# EAGLE schematic syma-wireless-charger (EAGLE 7.5.0)
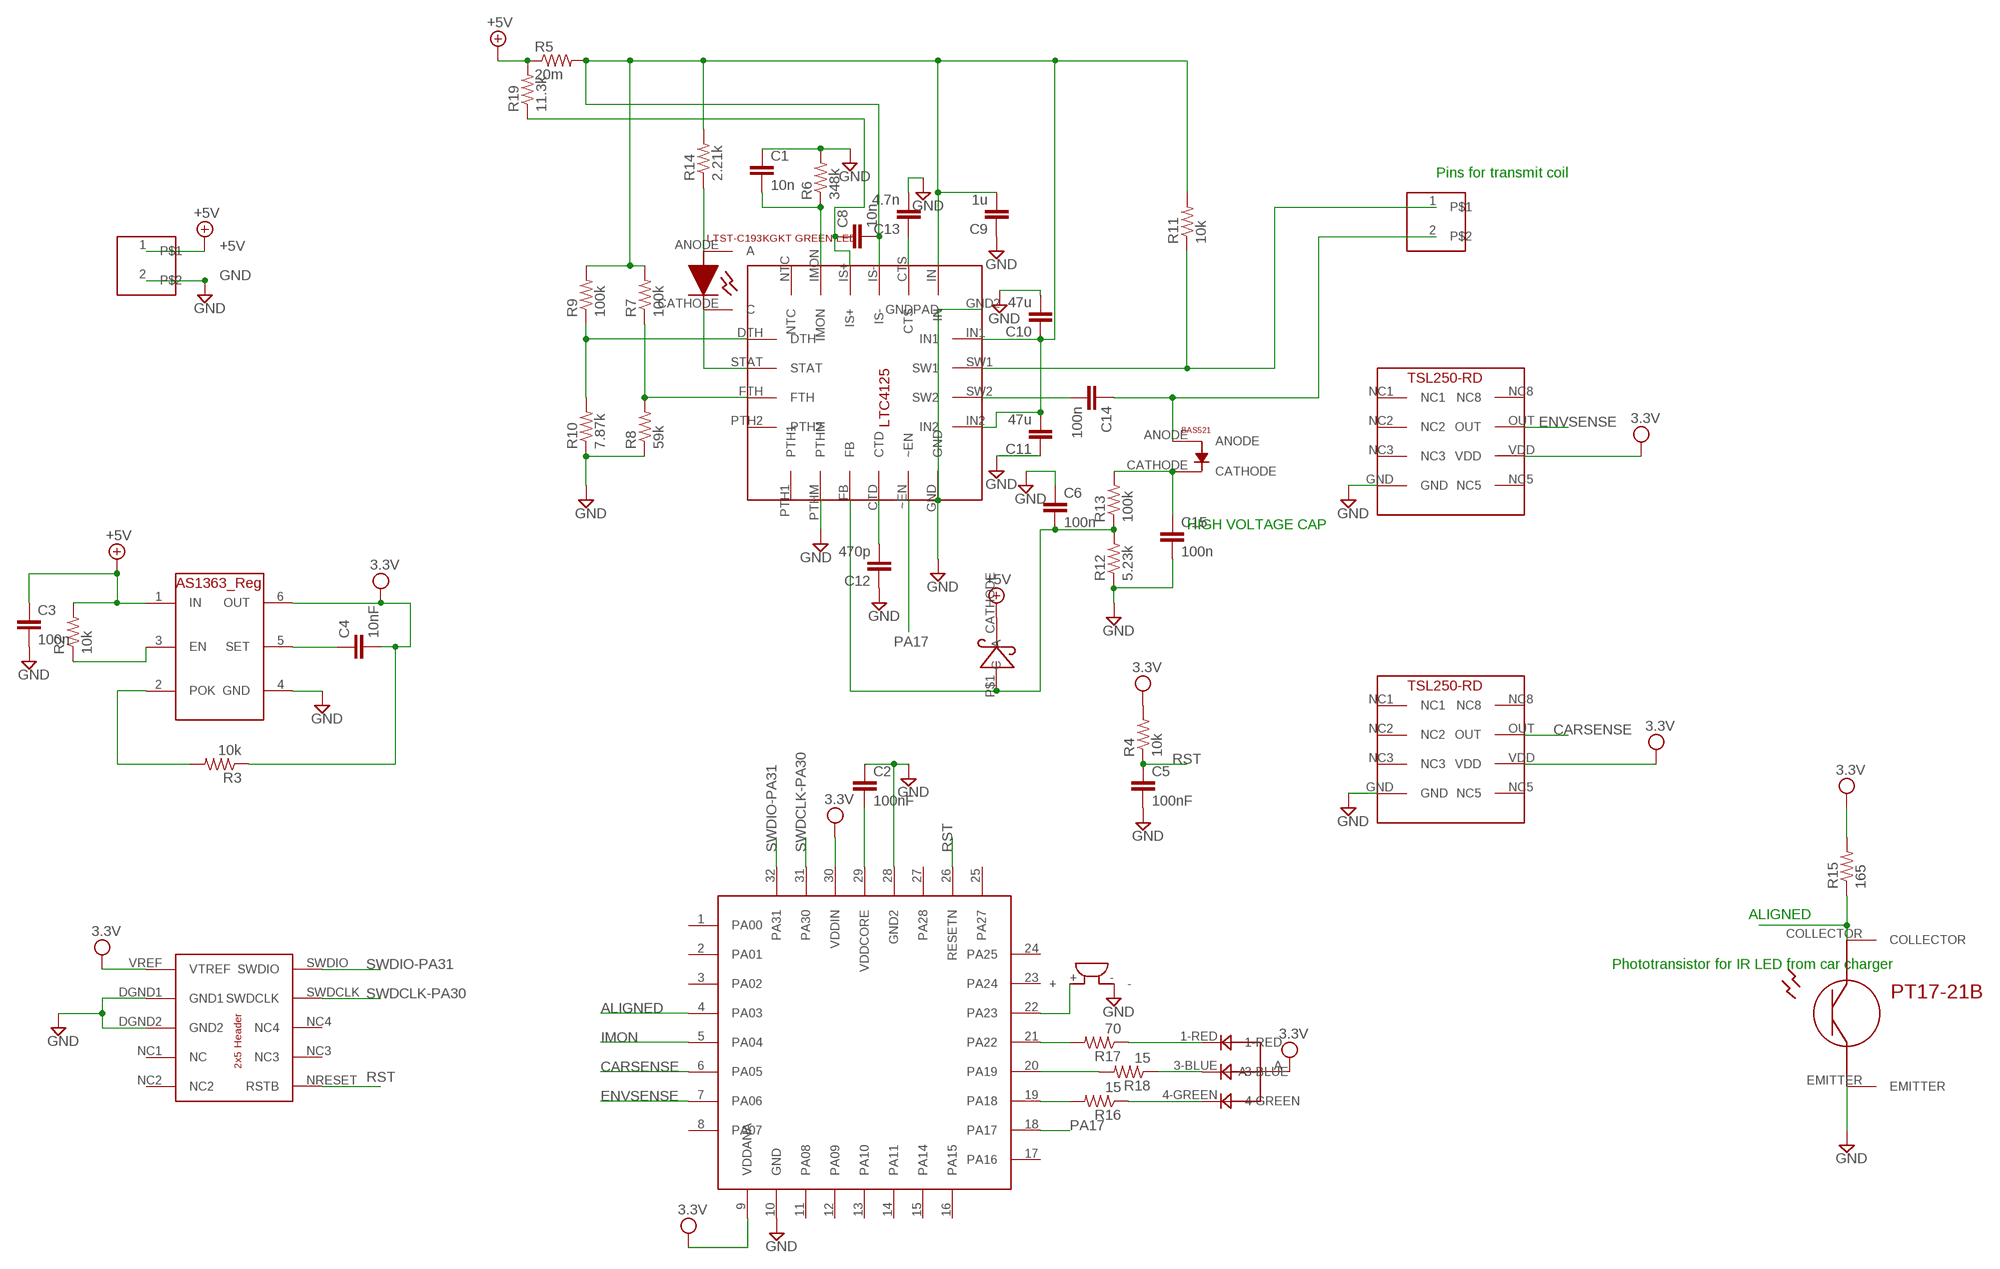
[diagram p0: schematic, sheet 1]

## Parts
C1  10n  C-EUC0805  [C0805]
C2  100nF  C-EUC0805K  [C0805K]
C3  100n  C-EUC0805K  [C0805K]
C4  10nF  C-EUC0805K  [C0805K]
C5  100nF  C-EUC0805K  [C0805K]
C6  100n  C-EUC0805  [C0805]
C8  10n  C-EUC0805  [C0805]
C9  1u  C-EUC0805  [C0805]
C10  47u  C-EUC0805  [C0805]
C11  47u  C-EUC0805  [C0805]
C12  470p  C-EUC0805  [C0805]
C13  4.7n  C-EUC0805  [C0805]
C14  100n  C-EUC1206  [C1206]
C15  100n  C-EUC0603  [C0603]
DBG1  DEBUGHEAD  [DEBUGHEAD]
R2  10k  R-US_R0805  [R0805]
R3  10k  R-US_R0805  [R0805]
R4  10k  R-US_R0805  [R0805]
R5  20m  R-US_R0805  [R0805]
R6  348k  R-US_R0805  [R0805]
R7  100k  R-US_R0805  [R0805]
R8  59k  R-US_R0805  [R0805]
R9  100k  R-US_R0805  [R0805]
R10  7.87k  R-US_R0805  [R0805]
R11  10k  R-US_R0805  [R0805]
R12  5.23k  R-US_R0805  [R0805]
R13  100k  R-US_R0805  [R0805]
R14  2.21k  R-US_R0805  [R0805]
R15  165  R-US_R0805  [R0805]
R16  15  R-US_R0805  [R0805]
R17  70  R-US_R0805  [R0805]
R18  15  R-US_R0805  [R0805]
R19  11.3k  R-US_R0805  [R0805]
U1  SAMD21E  [TQFP32-08]
U2  3.3V_AS1363  [SOT23-6]
U$1  LTC4125  [LTC1945-QFN]
U$2  BAS521  [BAS521-V-DIODE]
U$3  1X02  [1X02]
U$4  RGBLED  [RGBLED]
U$5  BUZZER  [BUZZER]
U$6  TSL250-RD  [TSL250-RD]
U$7  TSL250-RD  [TSL250-RD]
U$8  SCHTKYDIODE-523  [SOD-523]
U$9  LTST-C193KGKT_GREEN-LED  [LTST-C193KGKT_GREEN-LED]
U$10  PT17-21B_PHOTOTRANSISTOR  [PT17-21B_PHOTOTRANSISTOR]
U$11  1X02  [1X02]

## Nets
+5V: C3.1 R2.2 R5.1 R19.2 U2.1(IN) U$3.1 U$8.CATHODE(C)
ALIGNED: R15.1 U1.4(PA03) U$10.COLLECTOR
CARSENSE: U1.6(PA05) U$6.OUT
ENVSENSE: U1.7(PA06) U$7.OUT
GND: C1.1 C2.1 C3.2 C5.2 C6.1 C9.1 C10.2 C11.1 C12.1 C13.2 C15.2 DBG1.DGND1(GND1) DBG1.DGND2(GND2) R6.2 R8.1 R10.1 R12.1 U1.10(GND) U1.28(GND2) U2.4(GND) U$1.GND U$1.GND2(GNDPAD) U$1.PTHM U$3.2 U$5.- U$6.GND U$7.GND U$10.EMITTER
IMON: U1.5(PA04)
N$1: C2.2 U1.29(VDDCORE)
N$2: R3.2 U2.2(POK)
N$3: R2.1 U2.3(EN)
N$4: R9.1 R10.2 U$1.DTH
N$5: C4.1 U2.5(SET)
N$6: R7.1 R8.2 U$1.FTH
N$7: R11.1 U$1.SW1 U$11.1
N$8: C1.2 R6.1 U$1.IMON
N$9: C6.2 R12.2 R13.1 U$1.FB U$8.P$1(A)
N$10: C15.1 R13.2 U$2.CATHODE
N$11: R14.1 U$9.ANODE(A)
N$12: C14.1 U$2.ANODE U$11.2
N$13: R17.2 U1.21(PA22)
N$14: R18.2 U1.20(PA19)
N$15: R16.2 U1.19(PA18)
N$16: R16.1 U$4.4-GREEN
N$17: R18.1 U$4.3-BLUE
N$18: R17.1 U$4.1-RED
N$19: U1.22(PA23) U$5.+
N$20: C8.2 C9.2 C10.1 C11.2 R5.2 R7.2 R9.2 R11.2 R14.2 U$1.IN U$1.IN1 U$1.IN2 U$1.IS-
N$21: C8.1 R19.1 U$1.IS+
N$22: C14.2 U$1.SW2
N$23: U$1.STAT U$9.CATHODE(C)
N$24: C12.2 U$1.CTD
N$25: C13.1 U$1.CTS
PA17: U1.18(PA17) U$1.~EN
RST: C5.1 DBG1.NRESET(RSTB) R4.1 U1.26(RESETN)
SWDCLK-PA30: DBG1.SWDCLK U1.31(PA30)
SWDIO-PA31: DBG1.SWDIO U1.32(PA31)
VDD: C4.2 DBG1.VREF(VTREF) R3.1 R4.2 R15.2 U1.9(VDDANA) U1.30(VDDIN) U2.6(OUT) U$4.A U$6.VDD U$7.VDD ; supply symbol labelled 3.3V
Unconnected: DBG1.NC1(NC) DBG1.NC2 DBG1.NC3 DBG1.NC4 U1.1(PA00) U1.2(PA01) U1.3(PA02) U1.8(PA07) U1.11(PA08) U1.12(PA09) U1.13(PA10) U1.14(PA11) U1.15(PA14) U1.16(PA15) U1.17(PA16) U1.23(PA24) U1.24(PA25) U1.25(PA27) U1.27(PA28) U$1.NTC U$1.PTH1 U$1.PTH2 U$6.NC1 U$6.NC2 U$6.NC3 U$6.NC5 U$6.NC8 U$7.NC1 U$7.NC2 U$7.NC3 U$7.NC5 U$7.NC8

## Notes on the sheet
- Pins for transmit coil
- HIGH VOLTAGE CAP
- ALIGNED
- Phototransistor for IR LED from car charger

## Library data of the parts
C1 C6 C8-C14 = rcl:C-EU: CAPACITOR, European symbol
C2-C5 C15 = resistor:C-EU: CAPACITOR, European symbol
DBG1 = foe-scale:DEBUGHEAD
R2-R4 R15-R18 = resistor:R-US_: RESISTOR, American symbol
R5-R14 R19 = rcl:R-US_: RESISTOR, American symbol
U1 = foe-scale:SAMD21E
U2 = foe-scale:3.3V_AS1363
U$1 = foe-scale:LTC4125
U$2 = foe-scale:BAS521
U$3 U$11 = foe-scale:1X02
U$4 = foe-scale:RGBLED
U$5 = foe-scale:BUZZER
U$6 U$7 = foe-scale:TSL250-RD
U$8 = foe-scale:SCHTKYDIODE-523
U$9 = foe-scale:LTST-C193KGKT_GREEN-LED
U$10 = foe-scale:PT17-21B_PHOTOTRANSISTOR